# Altium schematic sheet PCI Express Mini_3000X5095_52PIN_Full-Mini-Type F2.schdoc: PCI Express F2 Top Sheet
size A4; SheetNumber: 1; SheetTotal: 2
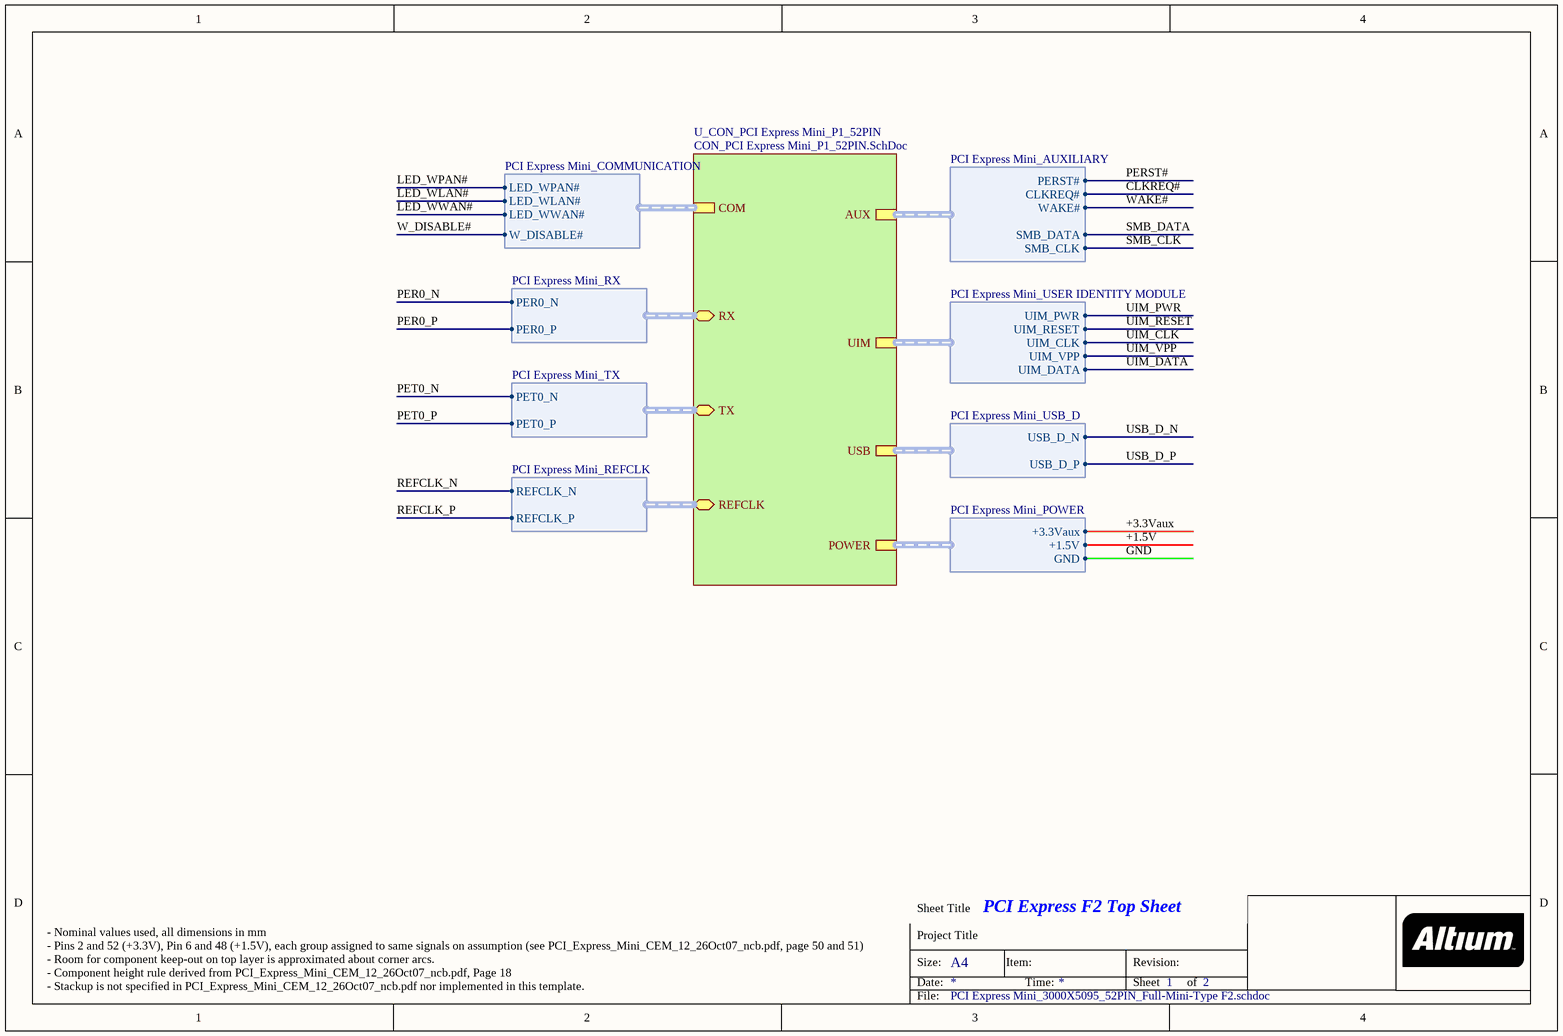
[diagram p0: PCI Express Mini_3000X5095_52PIN_Full-Mini-Type F2.schdoc]

## Sub-sheets
U_CON_PCI Express Mini_P1_52PIN = CON_PCI Express Mini_P1_52PIN.SchDoc: POWER (harness PCI Express Mini_POWER), COM (harness PCI Express Mini_COMMUNICATION), USB (harness PCI Express Mini_USB_D), AUX (harness PCI Express Mini_AUXILIARY), UIM (harness PCI Express Mini_USER IDENTITY MODULE), RX (harness PCI Express Mini_RX), TX (harness PCI Express Mini_TX), REFCLK (harness PCI Express Mini_REFCLK)

## Harnesses
PCI Express Mini_USB_D: USB_D_N, USB_D_P
PCI Express Mini_POWER: +3.3Vaux, +1.5V, GND
PCI Express Mini_AUXILIARY: PERST#, CLKREQ#, WAKE#, SMB_DATA, SMB_CLK
PCI Express Mini_COMMUNICATION: LED_WPAN#, LED_WLAN#, LED_WWAN#, W_DISABLE#
PCI Express Mini_USER IDENTITY MODULE: UIM_PWR, UIM_RESET, UIM_CLK, UIM_VPP, UIM_DATA
PCI Express Mini_REFCLK: REFCLK_N, REFCLK_P
PCI Express Mini_RX: PER0_N, PER0_P
PCI Express Mini_TX: PET0_N, PET0_P

## Nets
+1.5V: sheet U_CON_PCI Express Mini_P1_52PIN/POWER.+1.5V
+3.3Vaux: sheet U_CON_PCI Express Mini_P1_52PIN/POWER.+3.3Vaux
CLKREQ#: sheet U_CON_PCI Express Mini_P1_52PIN/AUX.CLKREQ#
GND: sheet U_CON_PCI Express Mini_P1_52PIN/POWER.GND
LED_WLAN#: sheet U_CON_PCI Express Mini_P1_52PIN/COM.LED_WLAN#
LED_WPAN#: sheet U_CON_PCI Express Mini_P1_52PIN/COM.LED_WPAN#
LED_WWAN#: sheet U_CON_PCI Express Mini_P1_52PIN/COM.LED_WWAN#
PER0_N: sheet U_CON_PCI Express Mini_P1_52PIN/RX.PER0_N
PER0_P: sheet U_CON_PCI Express Mini_P1_52PIN/RX.PER0_P
PERST#: sheet U_CON_PCI Express Mini_P1_52PIN/AUX.PERST#
PET0_N: sheet U_CON_PCI Express Mini_P1_52PIN/TX.PET0_N
PET0_P: sheet U_CON_PCI Express Mini_P1_52PIN/TX.PET0_P
REFCLK_N: sheet U_CON_PCI Express Mini_P1_52PIN/REFCLK.REFCLK_N
REFCLK_P: sheet U_CON_PCI Express Mini_P1_52PIN/REFCLK.REFCLK_P
SMB_CLK: sheet U_CON_PCI Express Mini_P1_52PIN/AUX.SMB_CLK
SMB_DATA: sheet U_CON_PCI Express Mini_P1_52PIN/AUX.SMB_DATA
UIM_CLK: sheet U_CON_PCI Express Mini_P1_52PIN/UIM.UIM_CLK
UIM_DATA: sheet U_CON_PCI Express Mini_P1_52PIN/UIM.UIM_DATA
UIM_PWR: sheet U_CON_PCI Express Mini_P1_52PIN/UIM.UIM_PWR
UIM_RESET: sheet U_CON_PCI Express Mini_P1_52PIN/UIM.UIM_RESET
UIM_VPP: sheet U_CON_PCI Express Mini_P1_52PIN/UIM.UIM_VPP
USB_D_N: sheet U_CON_PCI Express Mini_P1_52PIN/USB.USB_D_N
USB_D_P: sheet U_CON_PCI Express Mini_P1_52PIN/USB.USB_D_P
W_DISABLE#: sheet U_CON_PCI Express Mini_P1_52PIN/COM.W_DISABLE#
WAKE#: sheet U_CON_PCI Express Mini_P1_52PIN/AUX.WAKE#

## Notes on the sheet
- - Nominal values used, all dimensions in mm
  - Pins 2 and 52 (+3.3V), Pin 6 and 48 (+1.5V), each group assigned to same signals on assumption (see PCI_Express_Mini_CEM_12_26Oct07_ncb.pdf, page 50 and 51)
  - Room for component keep-out on top layer is approximated about corner arcs.
  - Component height rule derived from PCI_Express_Mini_CEM_12_26Oct07_ncb.pdf, Page 18
  - Stackup is not specified in PCI_Express_Mini_CEM_12_26Oct07_ncb.pdf nor implemented in this template.
- Sheet Title
- Project Title
- Size:
- Date:
- A4
- Item:
- Time:
- Revision:
- Sheet
- of
- File: